# Altium schematic sheet Digital_Io.SchDoc
size A
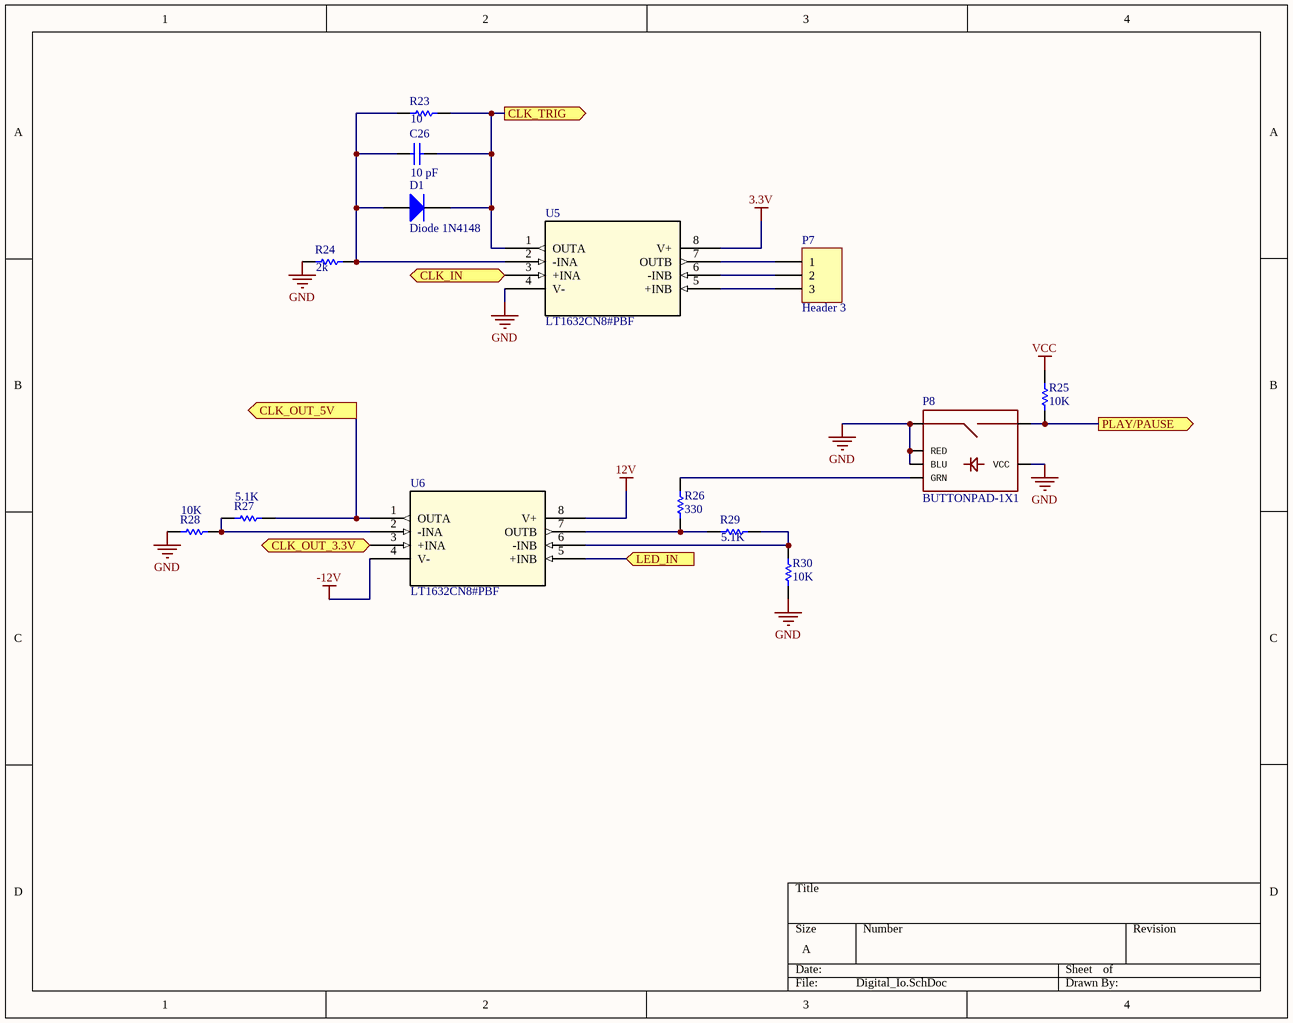
[diagram p0: Digital_Io.SchDoc]

## Parts
C26  value 10 pF  [C0805]
D1  Diode 1N4148  [DO-35]
P7  Header 3  [HDR1X3]
P8  BUTTONPAD-1X1  [BUTTONPAD-1X1]
R23  value 10  [AXIAL-0.3]  (hidden comment: Res1)
R24  value 2k  [AXIAL-0.3]  (hidden comment: Res1)
R25  value 10K  [AXIAL-0.3]  (hidden comment: R3)
R26  value 330  [AXIAL-0.3]  (hidden comment: Res1)
R27  value 5.1K  [AXIAL-0.3]  (hidden comment: Res1)
R28  value 10K  [AXIAL-0.3]  (hidden comment: Res1)
R29  value 5.1K  [AXIAL-0.3]  (hidden comment: Res1)
R30  value 10K  [AXIAL-0.3]  (hidden comment: Res1)
U5  LT1632CN8#PBF  [PDIP-8_N]
U6  LT1632CN8#PBF  [PDIP-8_N]

## Ports
CLK_IN (in), CLK_OUT_3.3V (in), CLK_OUT_5V (out), CLK_TRIG (out), LED_IN (in), PLAY/PAUSE (out)

## Nets
3.3V: U5.8(V+)
12V: U6.8(V+)
-12V: U6.4(V-)
GND: P8.BLU1(BLU) P8.RED1(RED) P8.SIG1 P8.VCC1(VCC) R24.1 R28.1 R30.1 U5.4(V-)
VCC: R25.2
CLK_IN: U5.3(+INA) ; port CLK_IN
CLK_OUT_3.3V: U6.3(+INA) ; port CLK_OUT_3.3V
CLK_OUT_5V: R27.2 U6.1(OUTA) ; port CLK_OUT_5V
CLK_TRIG: C26.1 D1.2(K) R23.2 U5.1(OUTA) ; port CLK_TRIG
LED_IN: U6.5(+INB) ; port LED_IN
PLAY/PAUSE: P8.SIG2 R25.1 ; port PLAY/PAUSE
NetC26_2: C26.2 D1.1(A) R23.1 R24.2 U5.2(-INA)
NetP7_1: P7.1 U5.7(OUTB)
NetP7_2: P7.2 U5.6(-INB)
NetP7_3: P7.3 U5.5(+INB)
NetP8_GRN1: P8.GRN1(GRN) R26.2
NetR26_1: R26.1 R29.1 U6.7(OUTB)
NetR27_1: R27.1 R28.2 U6.2(-INA)
NetR29_2: R29.2 R30.2 U6.6(-INB)

## Library data of the parts
C26 = Cap: Capacitor; Published: 8-Jun-2000; LatestRevisionDate: 17-Jul-2002; LatestRevisionNote: Re-released for DXP Platform.; PackageReference: RAD-0.3; Publisher: Altium Limited; PackageDescription: Radial Cap, Thru-Hole; 2 Leads; 0.3 in Pin Spacing
D1 = Diode 1N4148: High Conductance Fast Diode; Published: 8-Jun-2000; LatestRevisionDate: 17-Jul-2002; LatestRevisionNote: Re-released for DXP Platform.; DatasheetVersion: 1997; PackageReference: DO-35; Publisher: Altium Limited; PackageDescription: Diode, Axial; Body 3.8 x 1.9 mm (LxDia. max), Lead Dia. 0.53 mm (max); Code_JEDEC: DO-204-AH; ComponentLink1Description: Manufacturer Link; ComponentLink1URL: http://www.fairchildsemi.com/; ComponentLink2Description: Datasheet; ComponentLink2URL: http://www.fairchildsemi.com/ds/1N%2F1N4148.pdf
P7 = Header 3: Header, 3-Pin; LatestRevisionDate: 17-Jul-2002; LatestRevisionNote: Re-released for DXP Platform.; Publisher: Altium Limited
R23-R30 = Res1: Resistor; Published: 8-Jun-2000; LatestRevisionDate: 17-Jul-2002; LatestRevisionNote: Re-released for DXP Platform.; PackageReference: AXIAL-0.3; Publisher: Altium Limited; PackageDescription: Axial Device, Thru-Hole; 2 Leads; 0.3 in Pin Spacing
U5 U6 = LT1632CN8#PBF: Imported; Operating_Temperature: 0Â°C ~ 70Â°C; Current_-_Output_/_Channel: 70mA; Voltage_-_Input_Offset: 500ÂµV; Current_-_Input_Bias: 1.15ÂµA; Output_Type: Rail-to-Rail; Vendor: Linear Technology; Amplifier_Type: General Purpose; Number_of_Circuits: 2; Slew_Rate: 45 V/Âµs; Gain_Bandwidth_Product: 45MHz; Current_-_Supply: 4.6mA; Current_-_Output/Channel: 40mA; Voltage_-_Supply,_Single/Dual_(Â±): 2.7 V ~ 36 V, Â±1.35 V ~ 18 V; Mounting_Type: Through Hole; 3D_Library_Name: Maxim2; C: Copyright (C) 2016 Accelerated Designs. All rights reserved; -3db_Bandwidth: -; Series: *; Manufacturer_Part_Number: LT1632CN8#PBF; DigiKeyPartNumber: LT1632CN8-ND; Quantity_Available: 0; DataSheet: http://www.linear.com/docs/3055; Packaging: Tube; Package_/_Case: 8-DIP (0.300", 7.62mm); Copyright: Copyright (C) 2015 Accelerated Designs. All rights reserved; Supplier_Device_Package: 8-PDIP; Value: Value; Type: Type; RefDes: RefDes